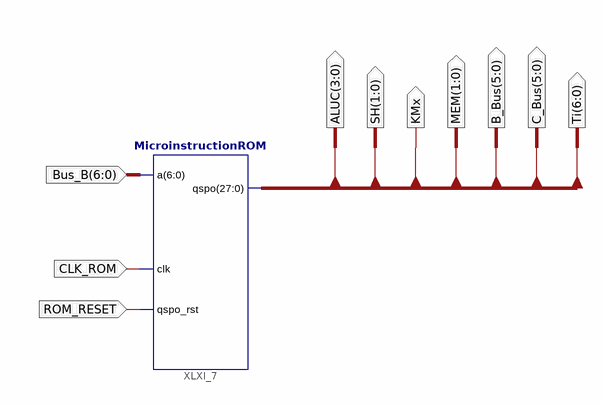
[diagram p0: schematic sheet 1]
// Xilinx ISE schematic MROM.sch (artix7) as structural Verilog: 1 symbols, 10 ports
module MROM (
  input  [6:0] Bus_B,
  input  CLK_ROM,
  input  ROM_RESET,
  output [6:0] Ti,
  output [5:0] C_Bus,
  output [5:0] B_Bus,
  output [1:0] MEM,
  output KMx,
  output [1:0] SH,
  output [3:0] ALUC
);

  MicroinstructionROM XLXI_7 (
    .a(Bus_B), .clk(CLK_ROM), .qspo_rst(ROM_RESET), .qspo({ALUC, SH, KMx, MEM, B_Bus, C_Bus, Ti}));
endmodule
